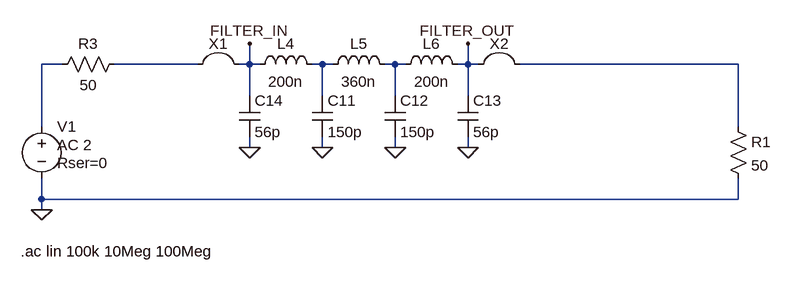
[diagram p0: schematic BandPass.asc]
BandPass.asc, the LTspice schematic file:
Version 4
SHEET 1 880 680
WIRE -2592 80 -2624 80
WIRE -2384 80 -2512 80
WIRE -2304 80 -2304 48
WIRE -2304 80 -2320 80
WIRE -2288 80 -2304 80
WIRE -2192 80 -2208 80
WIRE -2176 80 -2192 80
WIRE -2080 80 -2096 80
WIRE -2064 80 -2080 80
WIRE -1968 80 -1968 48
WIRE -1968 80 -1984 80
WIRE -1952 80 -1968 80
WIRE -1552 80 -1888 80
WIRE -2304 128 -2304 80
WIRE -2192 128 -2192 80
WIRE -2080 128 -2080 80
WIRE -1968 128 -1968 80
WIRE -2624 176 -2624 80
WIRE -1552 176 -1552 80
WIRE -2304 208 -2304 192
WIRE -2192 208 -2192 192
WIRE -2080 208 -2080 192
WIRE -1968 208 -1968 192
WIRE -2624 288 -2624 256
WIRE -1552 288 -1552 256
WIRE -1552 288 -2624 288
WIRE -2624 304 -2624 288
FLAG -2624 304 0
FLAG -2304 208 0
FLAG -2192 208 0
FLAG -2080 208 0
FLAG -1968 208 0
FLAG -2304 48 FILTER_IN
FLAG -1968 48 FILTER_OUT
SYMBOL voltage -2624 160 R0
WINDOW 3 24 44 Left 2
WINDOW 123 24 44 Left 2
WINDOW 39 24 72 Left 2
SYMATTR Value ""
SYMATTR Value2 AC 2
SYMATTR SpiceLine Rser=0
SYMATTR InstName V1
SYMBOL res -2608 96 R270
WINDOW 0 32 56 VTop 2
WINDOW 3 0 56 VBottom 2
SYMATTR InstName R3
SYMATTR Value 50
SYMBOL res -1568 160 R0
SYMATTR InstName R1
SYMATTR Value 50
SYMBOL ind -2304 96 R270
WINDOW 0 32 56 VTop 2
WINDOW 3 5 56 VBottom 2
SYMATTR InstName L4
SYMATTR Value 200n
SYMBOL ind -2192 96 R270
WINDOW 0 32 56 VTop 2
WINDOW 3 5 56 VBottom 2
SYMATTR InstName L5
SYMATTR Value 360n
SYMBOL ind -2080 96 R270
WINDOW 0 32 56 VTop 2
WINDOW 3 5 56 VBottom 2
SYMATTR InstName L6
SYMATTR Value 200n
SYMBOL cap -2208 128 R0
SYMATTR InstName C11
SYMATTR Value 150p
SYMBOL cap -2096 128 R0
SYMATTR InstName C12
SYMATTR Value 150p
SYMBOL cap -1984 128 R0
SYMATTR InstName C13
SYMATTR Value 56p
SYMBOL cap -2320 128 R0
SYMATTR InstName C14
SYMATTR Value 56p
SYMBOL Misc\\jumper -2352 16 R0
SYMATTR InstName X1
SYMBOL Misc\\jumper -1920 16 R0
SYMATTR InstName X2
TEXT -2656 368 Left 2 !.ac lin 100k 10Meg 100Meg

The netlist it stands for:
* BandPass.asc
V1 N001 0 AC 2 Rser=0
R3 N001 FILTER_IN 50
R1 FILTER_OUT 0 50
L4 FILTER_IN N002 200n
L5 N002 N003 360n
L6 N003 FILTER_OUT 200n
C11 N002 0 150p
C12 N003 0 150p
C13 FILTER_OUT 0 56p
C14 FILTER_IN 0 56p
.ac lin 100k 10Meg 100Meg
.backanno
.end